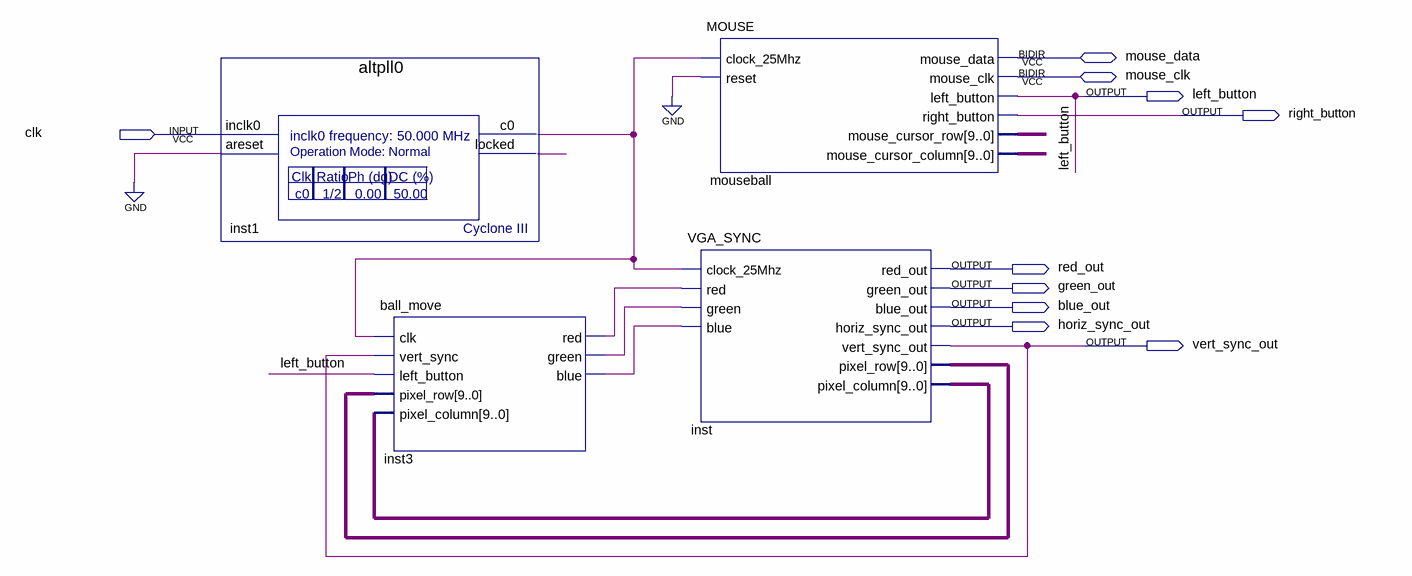
[diagram p0: schematic sheet]
// Quartus schematic ball_example.bdf as structural Verilog: 4 symbols, 10 pins
module ball_example (
  input  clk,
  inout  mouse_data,
  inout  mouse_clk,
  output left_button,
  output right_button,
  output red_out,
  output green_out,
  output blue_out,
  output horiz_sync_out,
  output vert_sync_out
);

  wire inst1_c0, inst1_locked, inst3_blue, inst3_green, inst3_red;
  wire [9:0] inst_pixel_column, inst_pixel_row, mouseball_mouse_cursor_column, mouseball_mouse_cursor_row;

  altpll0 inst1 (.inclk0(clk), .areset(1'b0), .c0(inst1_c0), .locked(inst1_locked));
  ball_move inst3 (
    .clk(inst1_c0), .vert_sync(vert_sync_out), .left_button(left_button), .pixel_row(inst_pixel_row),
    .pixel_column(inst_pixel_column), .red(inst3_red), .green(inst3_green), .blue(inst3_blue));
  MOUSE mouseball (
    .clock_25Mhz(inst1_c0), .reset(1'b0), .left_button(left_button), .right_button(right_button),
    .mouse_cursor_row(mouseball_mouse_cursor_row), .mouse_cursor_column(mouseball_mouse_cursor_column),
    .mouse_data(mouse_data), .mouse_clk(mouse_clk));
  VGA_SYNC inst (
    .clock_25Mhz(inst1_c0), .red(inst3_red), .green(inst3_green), .blue(inst3_blue), .red_out(red_out),
    .green_out(green_out), .blue_out(blue_out), .horiz_sync_out(horiz_sync_out),
    .vert_sync_out(vert_sync_out), .pixel_row(inst_pixel_row), .pixel_column(inst_pixel_column));
endmodule
